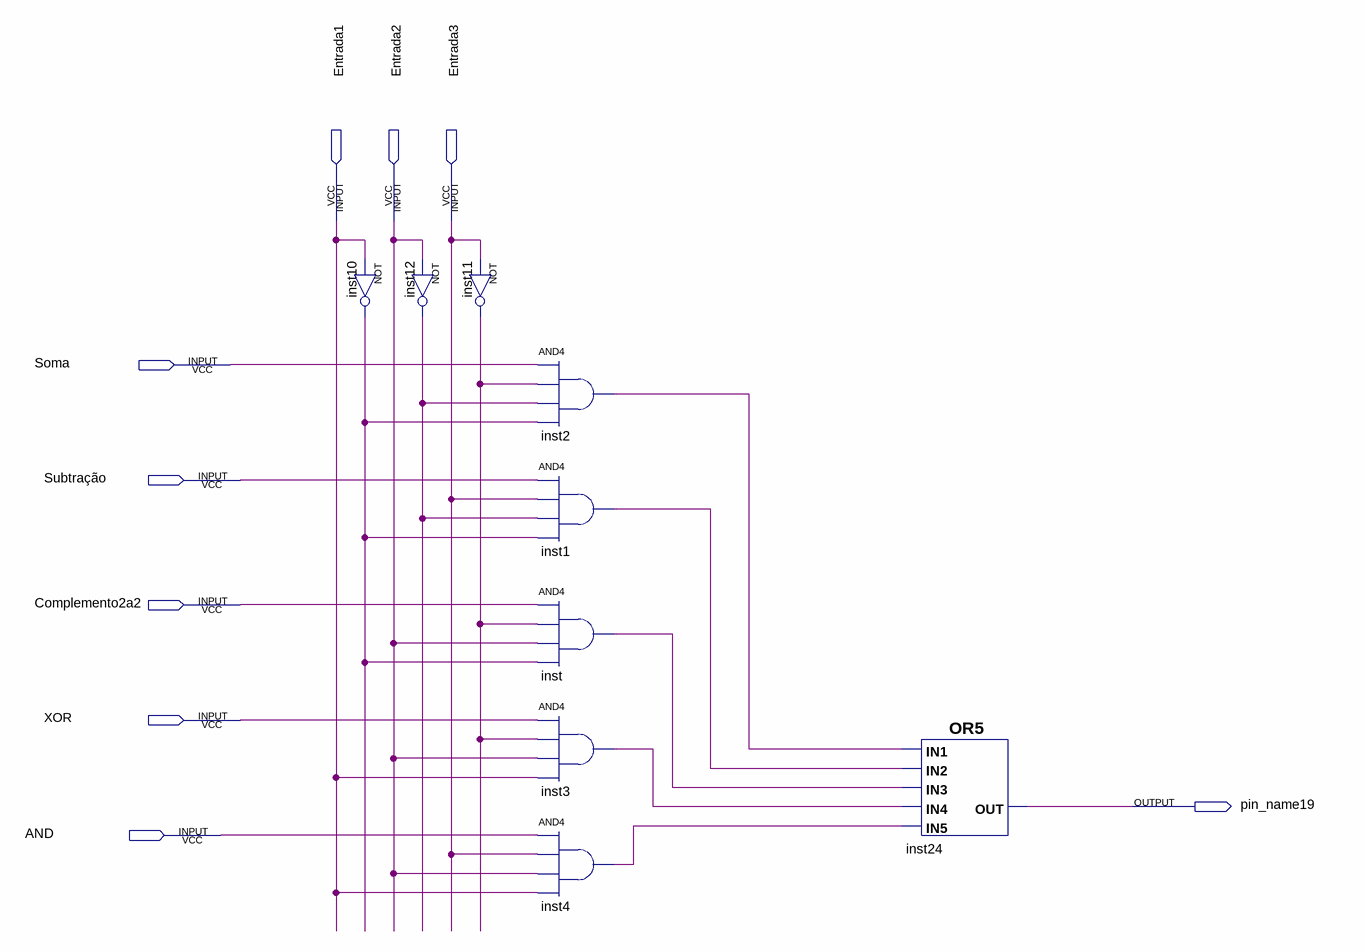
[diagram p0: schematic sheet]
// Quartus schematic Multiplex_vetor_completo.bdf as structural Verilog: 9 symbols, 9 pins
module Multiplex_vetor_completo (
  input  Entrada1,
  input  Entrada2,
  input  Entrada3,
  input  Soma,
  input  \Subtração ,
  input  Complemento2a2,
  input  XOR,
  input  AND,
  output pin_name19
);

  wire inst1_out, inst2_out, inst3_out, inst4_out, inst10_out, inst11_out, inst12_out, inst_out;

  not inst10 (inst10_out, Entrada1);
  not inst12 (inst12_out, Entrada2);
  not inst11 (inst11_out, Entrada3);
  and inst2 (inst2_out, Soma, inst11_out, inst12_out, inst10_out);
  and inst1 (inst1_out, \Subtração , Entrada3, inst12_out, inst10_out);
  and inst (inst_out, Complemento2a2, inst11_out, Entrada2, inst10_out);
  and inst3 (inst3_out, XOR, inst11_out, Entrada2, Entrada1);
  and inst4 (inst4_out, AND, Entrada3, Entrada2, Entrada1);
  or inst24 (pin_name19, inst2_out, inst1_out, inst_out, inst3_out, inst4_out);
endmodule
